# EAGLE design Tstat (EAGLE 6.5.0)
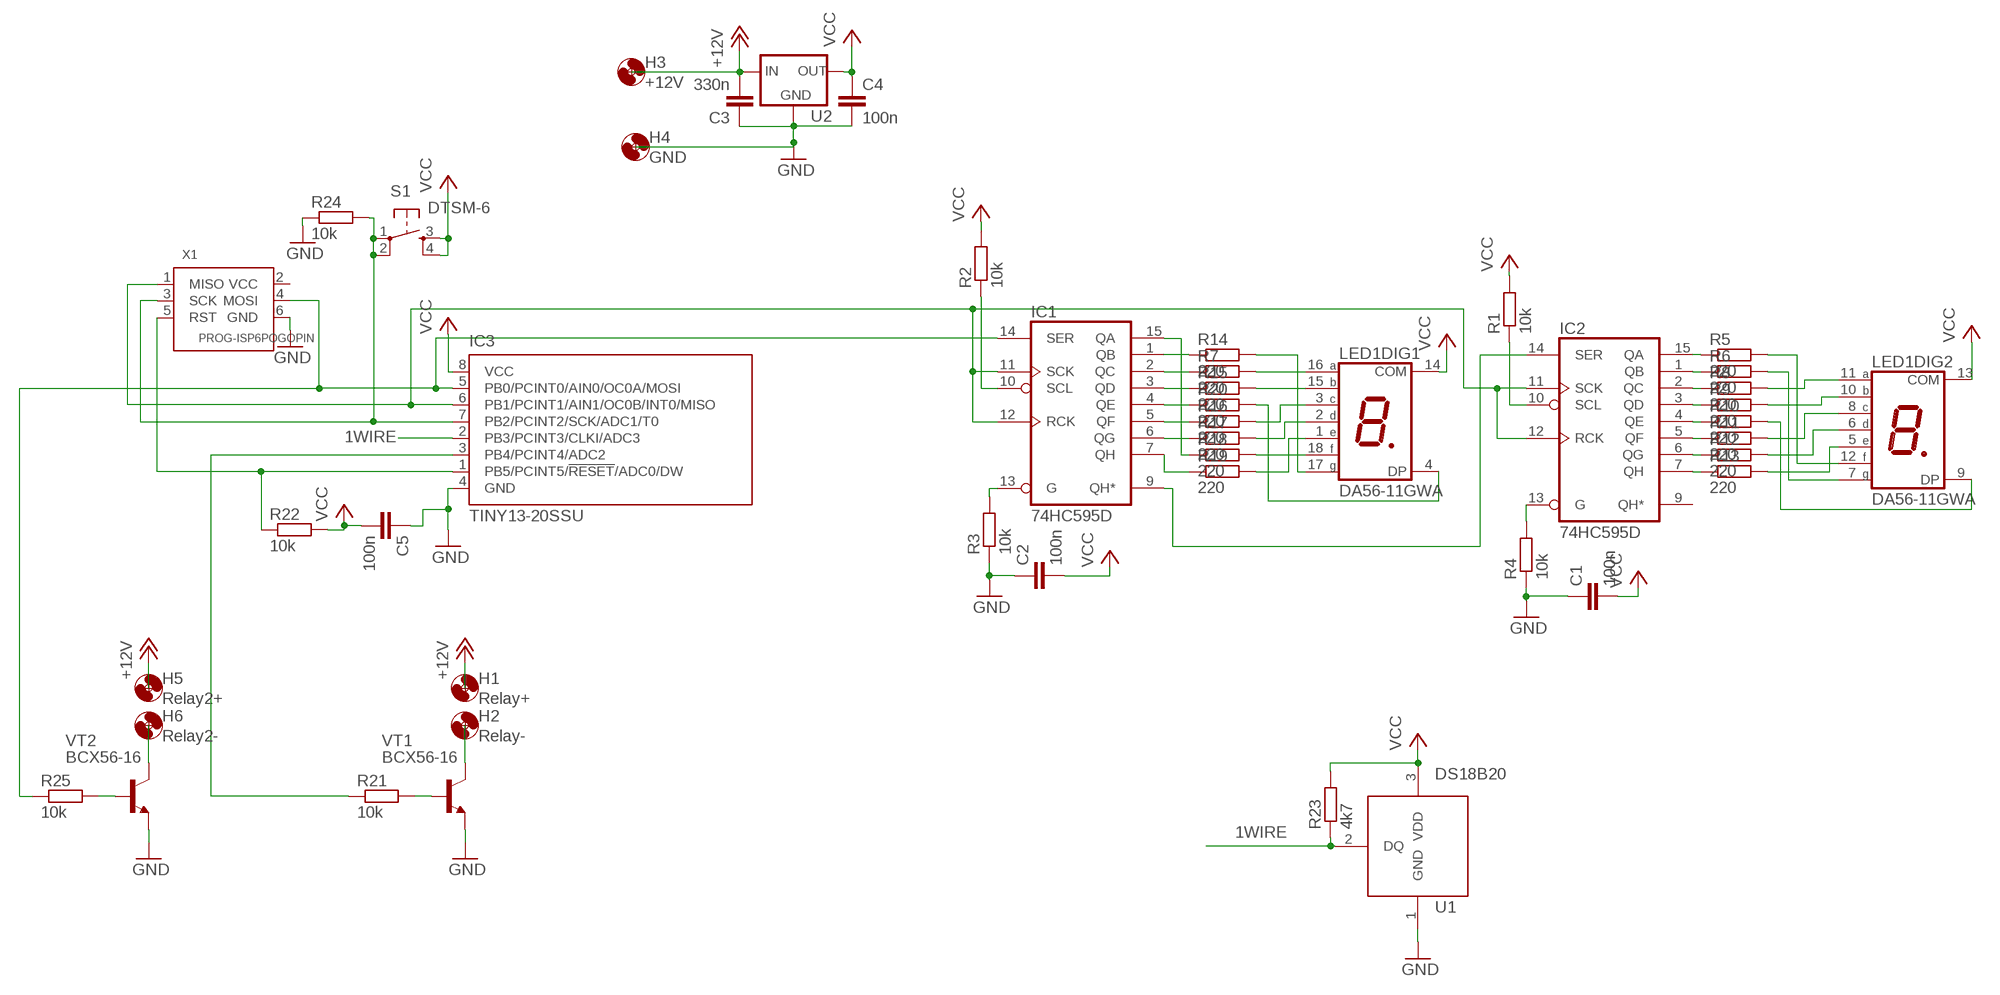
[diagram p0: schematic, sheet 1]

## Parts
C1  100n  C-EUC0805  [C0805]
C2  100n  C-EUC0805  [C0805]
C3  330n  C-EUC0805  [C0805]
C4  100n  C-EUC0805  [C0805]
C5  100n  C-EUC0805  [C0805]
H1  Relay+  MOUNT-HOLE3.0  [3,0]
H2  Relay-  MOUNT-HOLE3.0  [3,0]
H3  +12V  MOUNT-HOLE3.0  [3,0]
H4  GND  MOUNT-HOLE3.0  [3,0]
H5  Relay2+  MOUNT-HOLE3.0  [3,0]
H6  Relay2-  MOUNT-HOLE3.0  [3,0]
IC1  74HC595D  [SO16]
IC2  74HC595D  [SO16]
IC3  TINY13-20SSU  [8S1]
LED1  DA56-11GWA  [DA56]
R1  10k  R-EU_R0603  [R0603]
R2  10k  R-EU_R0603  [R0603]
R3  10k  R-EU_R0603  [R0603]
R4  10k  R-EU_R0603  [R0603]
R5  220  R-EU_R0603  [R0603]
R6  220  R-EU_R0603  [R0603]
R7  220  R-EU_R0603  [R0603]
R8  220  R-EU_R0603  [R0603]
R9  220  R-EU_R0603  [R0603]
R10  220  R-EU_R0603  [R0603]
R11  220  R-EU_R0603  [R0603]
R12  220  R-EU_R0603  [R0603]
R13  220  R-EU_R0603  [R0603]
R14  220  R-EU_R0603  [R0603]
R15  220  R-EU_R0603  [R0603]
R16  220  R-EU_R0603  [R0603]
R17  220  R-EU_R0603  [R0603]
R18  220  R-EU_R0603  [R0603]
R19  220  R-EU_R0603  [R0603]
R20  220  R-EU_R0603  [R0603]
R21  10k  R-EU_R0603  [R0603]
R22  10k  R-EU_R0603  [R0603]
R23  4k7  R-EU_R0603  [R0603]
R24  10k  R-EU_R0603  [R0603]
R25  10k  R-EU_R0603  [R0603]
S1  DTSM-6  [DTSM-6]
U1  DS18B20  [TO92]
U2  L78XX/TO263  [TO263]
VT1  BCX56-16  [SOT89-BCE]
VT2  BCX56-16  [SOT89-BCE]
X1  PROG-ISP6POGOPIN  [PROG_POGOPIN]

## Nets
1WIRE: IC3.2(PB3/PCINT3/CLKI/ADC3) R23.1 U1.2(DQ)
+12V: C3.2 H1.P$1 H3.P$1 H5.P$1 U2.1(IN)
GND: C1.1 C2.1 C3.1 C4.2 C5.1 H4.P$1 IC3.4(GND) R3.1 R4.1 R24.1 U1.1(GND) U2.3(GND) VT1.E VT2.E X1.6(GND)
N$1: IC1.15(QA) R18.1
N$2: LED1.17(DIG1:G) R14.2
N$3: LED1.16(DIG1:A) R7.2
N$4: LED1.15(DIG1:B) R15.2
N$5: LED1.4(DIG1:DP) R20.2
N$6: LED1.3(DIG1:C) R16.2
N$7: LED1.2(DIG1:D) R17.2
N$8: LED1.1(DIG1:E) R19.2
N$9: LED1.12(DIG2:F) R5.2
N$10: LED1.7(DIG2:G) R6.2
N$11: LED1.11(DIG2:A) R8.2
N$12: LED1.10(DIG2:B) R9.2
N$13: LED1.9(DIG2:DP) R10.2
N$14: LED1.8(DIG2:C) R11.2
N$15: LED1.6(DIG2:D) R12.2
N$16: LED1.5(DIG2:E) R13.2
N$17: IC1.9(QH*) IC2.14(SER)
N$18: IC2.10(SCL) R1.1
N$19: IC2.13(G) R4.2
N$20: IC1.13(G) R3.2
N$21: IC1.10(SCL) R2.1
N$22: IC2.15(QA) R5.1
N$23: IC1.11(SCK) IC1.12(RCK) IC2.11(SCK) IC2.12(RCK) IC3.6(PB1/PCINT1/AIN1/OC0B/INT0/MISO) X1.1(MISO)
N$24: IC2.1(QB) R6.1
N$25: IC2.2(QC) R8.1
N$26: IC2.3(QD) R9.1
N$27: IC2.4(QE) R10.1
N$28: IC2.5(QF) R11.1
N$29: IC2.6(QG) R12.1
N$30: IC2.7(QH) R13.1
N$31: IC1.1(QB) R14.1
N$32: IC1.2(QC) R7.1
N$33: IC1.3(QD) R15.1
N$34: IC1.5(QF) R16.1
N$35: IC1.6(QG) R17.1
N$36: LED1.18(DIG1:F) R18.2
N$37: IC1.7(QH) R19.1
N$38: IC1.4(QE) R20.1
N$39: H2.P$1 VT1.C VT1.C@1(C)
N$40: R21.2 VT1.B
N$41: IC1.14(SER) IC3.5(PB0/PCINT0/AIN0/OC0A/MOSI) R25.1 X1.4(MOSI)
N$42: H6.P$1 VT2.C VT2.C@1(C)
N$43: IC3.7(PB2/PCINT2/SCK/ADC1/T0) R24.2 S1.1 S1.2 X1.3(SCK)
N$44: IC3.1(PB5/PCINT5/!RESET!/ADC0/DW) R22.1 X1.5(RST)
N$45: R25.2 VT2.B
N$46: IC3.3(PB4/PCINT4/ADC2) R21.1
VCC: C1.2 C2.2 C4.1 C5.2 IC3.8(VCC) LED1.13(DIG2:COM) LED1.14(DIG1:COM) R1.2 R2.2 R22.2 R23.2 S1.3 S1.4 U1.3(VDD) U2.2(OUT)
Unconnected: IC2.9(QH*) X1.2(VCC)

## Power pins joined to a net without a drawn wire
GND: IC1.8(GND) IC2.8(GND)
VCC: IC1.16(VCC) IC2.16(VCC)

## Library data of the parts
C1-C5 = rcl:C-EU: CAPACITOR, European symbol
H1-H6 = holes:MOUNT-HOLE: MOUNTING HOLE with drill center marker
IC1 IC2 = 74xx-eu:74*595: 8-bit SHIFT REGISTER, output latch
IC3 = atmel:TINY13: 8-bit AVR Microcontroller with 1K Bytes In-System Programmable Flash Source: http://www.atmel.com/dyn/resources/prod_documents/2535S.pdf; MPN: ATTINY13-20SSU; OC_FARNELL: 1455133; OC_NEWARK: 58M3771
LED1 = usb:DA56-11: 14.22mm (0.56INCH) DUAL DIGIT NUMERIC DISPLAYS Source: www.kingbright.com .. DA56-11SRWA.pdf; OC_FARNELL: unknown; OC_NEWARK: unknown
R1-R25 = rcl:R-EU_: RESISTOR, European symbol
S1 = switch-tact:DTSM-6
U1 = usb:DS18B20: DS18B20
U2 = v-reg:L78XX/TO263
VT1 VT2 = usb:BCX56-16
X1 = usb:PROG-ISP

## Board
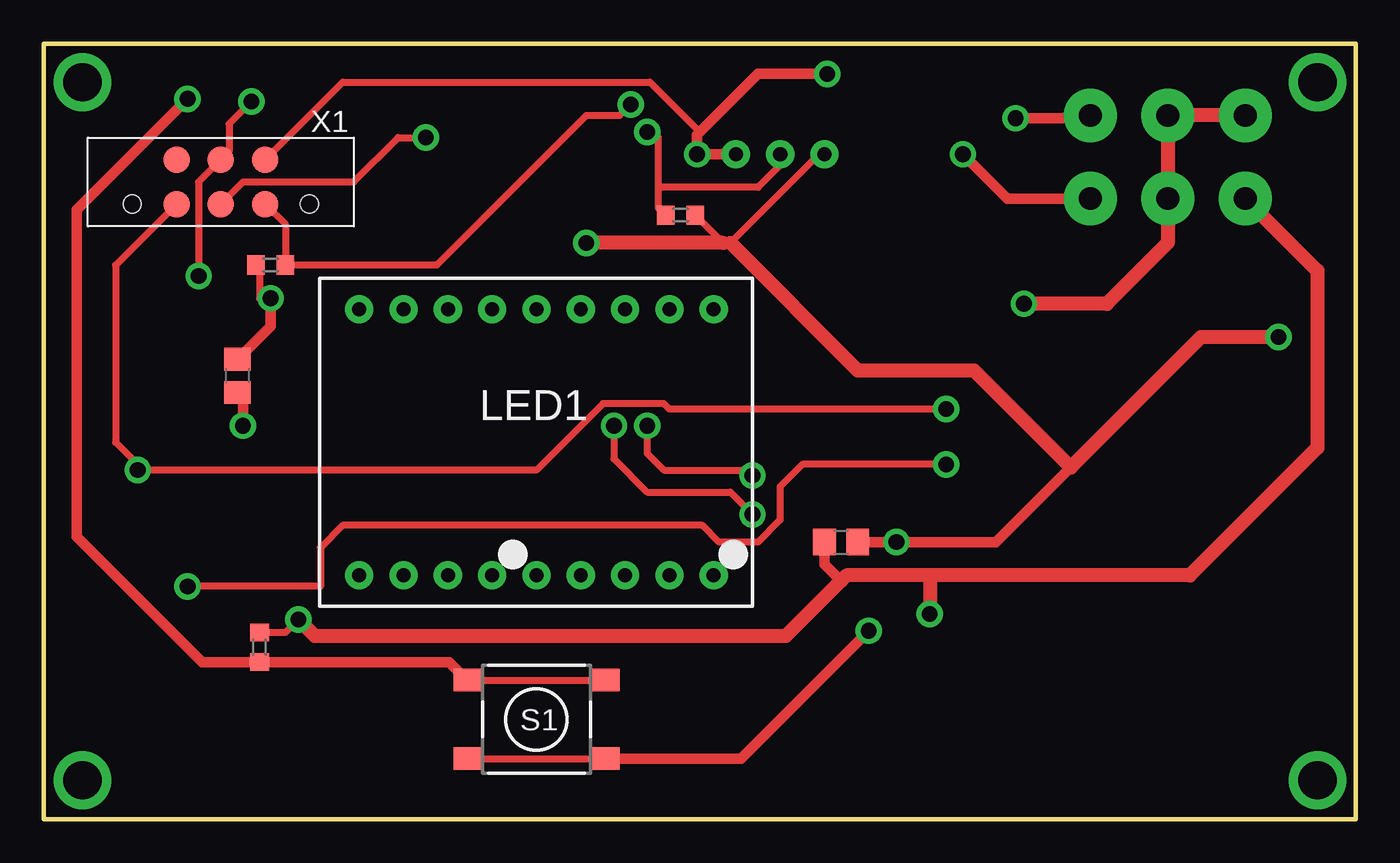
[diagram p1: board, top side]
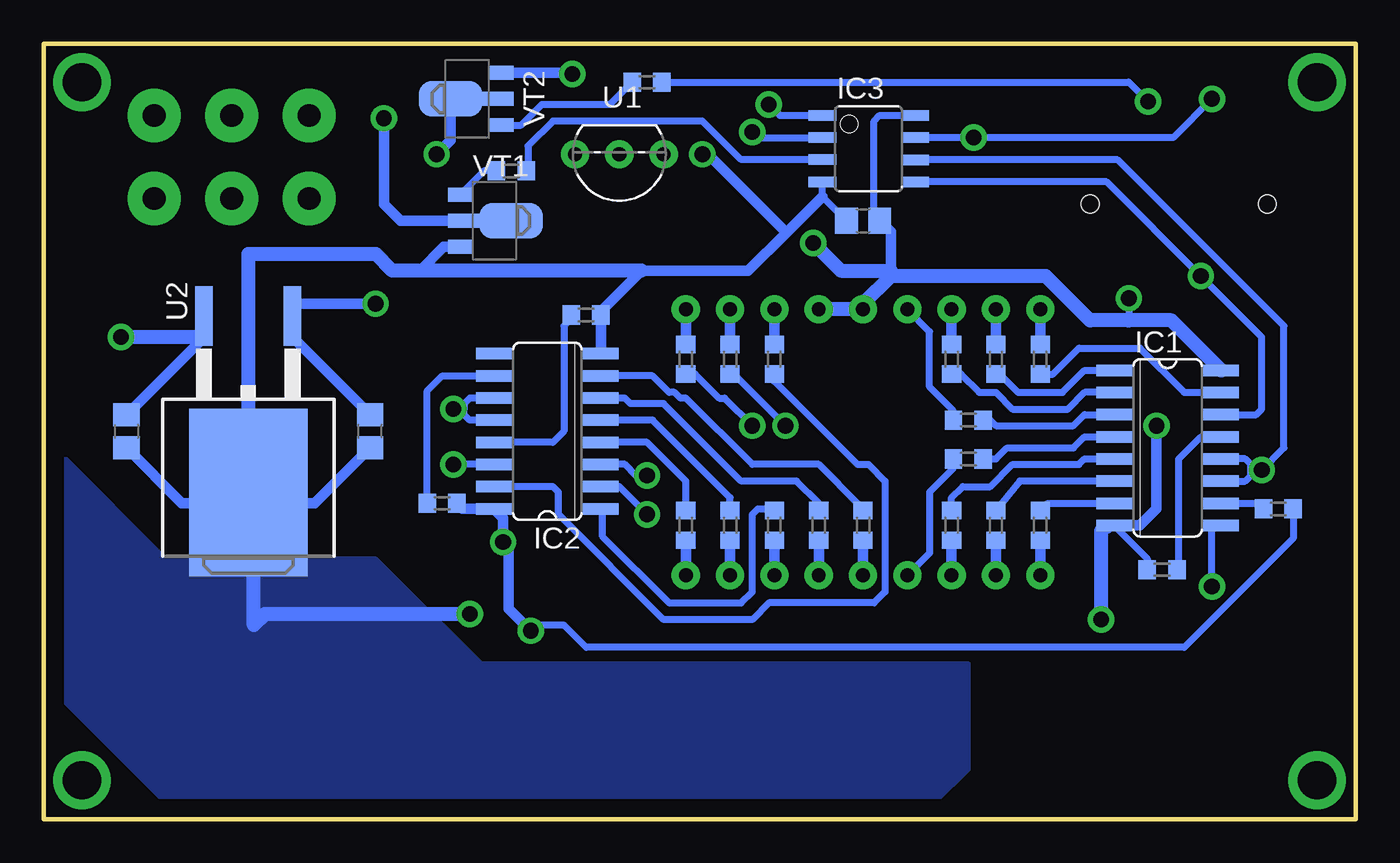
[diagram p2: board, bottom side, seen from below]

Size 75.23 x 44.44 mm. Coordinates in mm from the lower left corner, seen from the top.
Outline: 0,0 75.23,0 75.23,44.44 0,44.44 0,0
Copper layers (1*16): Top 0.035mm / dielectric 1.5mm / Bottom 0.035mm
Design rules "default": minimum track width 12mil, minimum drill 32mil, track to track 12mil, track to pad 12mil, pad to pad 12mil, via to via 12mil, smd to smd 8mil, copper to edge 40mil, drill to drill 8mil, minimum pad ring 16mil, minimum via ring 12mil, stop-mask expansion 4mil, vias tented up to drill 0mil, thermal gap 20mil

### Footprints (pad centres in the part's own frame; a part is rotated, then mirrored left to right if it is on the bottom)
C0805 = smd 1.3 x 1.5: 1 -0.95,0; 2 0.95,0
3,0 = drill 1.3 pad 3.048: P$1 0,0
SO16 = smd 0.66 x 2.032: 1 -4.445,-3.073; 2 -3.175,-3.073; 3 -1.905,-3.073; 4 -0.635,-3.073; 5 0.635,-3.073; 6 1.905,-3.073; 7 3.175,-3.073; 8 4.445,-3.073; 9 4.445,3.073; 10 3.175,3.073; 11 1.905,3.073; 12 0.635,3.073; 13 -0.635,3.073; 14 -1.905,3.073; 15 -3.175,3.073; 16 -4.445,3.073
8S1 = smd 0.6 x 1.6: 1 -1.905,-2.654; 2 -0.645,-2.654; 3 0.625,-2.654; 4 1.895,-2.654; 5 1.905,2.654; 6 0.635,2.654; 7 -0.635,2.654; 8 -1.905,2.654
DA56 = drill 0.8 pad 1.422: 1 -10.16,-7.62; 2 -7.62,-7.62; 3 -5.08,-7.62; 4 -2.54,-7.62; 5 0,-7.62; 6 2.54,-7.62; 7 5.08,-7.62; 8 7.62,-7.62; 9 10.16,-7.62; 10 10.16,7.62; 11 7.62,7.62; 12 5.08,7.62; 13 2.54,7.62; 14 0,7.62; 15 -2.54,7.62; 16 -5.08,7.62; 17 -7.62,7.62; 18 -10.16,7.62
R0603 = smd 1 x 1.1: 1 -0.85,0; 2 0.85,0
DTSM-6 = smd 1.55 x 1.3: 1 -3.975,2.25; 2 3.975,2.25; 3 -3.975,-2.25; 4 3.975,-2.25
TO92 = drill 0.813: 1 -2.54,0; 2 0,0; 3 2.54,0
TO263 = smd 1 x 3.4: 1 -2.54,-6.6; 2 2.54,-6.6 | smd 6.8 x 9.6: 3 0,3.5
SOT89-BCE = smd 0.8 x 1.4: B -1.499,-1.981; E 1.499,-1.981 | smd 0.8 x 1.9: C 0,-1.727 | smd 2.032 x 3.65: C@1 0,0.94
PROG_POGOPIN = smd 1.524 x 1.524: 1 0,7.62; 2 2.54,7.62; 3 0,5.08; 4 2.54,5.08; 5 0,2.54; 6 2.54,2.54 | hole 1.016: 0,0; 0,10.16

### Placement (x,y rotation side)
C1  45.72,15.88 0 top
C2  11.11,25.4 90 top
C3  56.52,22.23 90 bottom
C4  70.48,22.23 270 bottom
C5  28.26,34.29 0 bottom
H1  64.45,35.56 0 top
H2  60.01,40.32 0 top
H3  68.9,40.32 0 top
H4  68.9,35.56 0 top
H5  64.45,40.32 0 top
H6  60.01,35.56 0 top
IC1  10.79,21.27 270 bottom
IC2  46.35,22.23 90 bottom
IC3  27.94,38.42 270 bottom
LED1  28.26,21.59 0 top
R1  52.39,18.1 0 bottom
R2  4.45,17.78 0 bottom
R3  11.11,14.29 0 bottom
R4  44.13,28.89 180 bottom
R5  33.34,26.35 90 bottom
R6  33.34,16.83 270 bottom
R7  23.18,26.35 90 bottom
R8  35.88,26.35 90 bottom
R9  38.42,26.35 90 bottom
R10  38.42,16.83 270 bottom
R11  35.88,16.83 270 bottom
R12  30.8,16.83 270 bottom
R13  28.26,16.83 270 bottom
R14  20.64,26.35 90 bottom
R15  22.23,22.86 180 bottom
R16  23.18,16.83 270 bottom
R17  20.64,16.83 270 bottom
R18  18.1,26.35 90 bottom
R19  18.1,16.83 270 bottom
R20  22.23,20.64 180 bottom
R21  48.42,37.15 180 bottom
R22  13.02,31.75 180 top
R23  36.51,34.61 0 top
R24  12.38,9.84 270 top
R25  40.64,42.23 180 bottom
S1  28.26,5.71 0 top
U1  42.23,38.1 180 bottom
U2  63.5,22.23 180 bottom
VT1  49.37,34.29 270 bottom
VT2  50.96,41.27 90 bottom
X1  15.24,35.24 90 top

### Tracks (layer width: path | path; a pad name or v marks a point on that pad's centre or on a via)
1WIRE  (via drill 0.9)
  Top 0.406: 35.24,36.2 40.96,36.2 42.23,37.47 U1.2 | 35.24,36.2 35.24,39.05 34.92,39.37 v34.61,39.37 | R23.1 35.24,35.03 35.24,36.2
  Bottom 0.406: v34.61,39.37 34.29,39.05 30.6,39.05 IC3.2
+12V  (via drill 0.9)
  Top 0.813: H3.P$1 H5.P$1 H1.P$1 64.45,33.02 60.96,29.53 v56.2,29.53
  Bottom 0.61: C3.2 60.96,27.62 U2.1 60.96,29.53 v56.2,29.53
GND  (via drill 0.9)
  Top 0.406: X1.6 17.14,42.23 34.77,42.23 37.47,39.53 37.47,39.21 | R24.1 13.87,10.69 v14.61,11.43
  Top 0.61: C2.1 11.43,24.13 v11.43,22.54 | C1.1 44.77,14.6 45.72,13.65 | U1.1 v37.47,38.1 37.47,39.21 40.96,42.7 v44.93,42.7
  Top 0.813: H4.P$1 73.03,31.43 73.03,21.27 65.72,13.97 50.8,13.97 | 50.8,13.97 46.04,13.97 45.72,13.65 42.55,10.48 15.56,10.48 v14.61,11.43 | 50.8,13.97 v50.8,11.75
  Bottom 0.305: 14.61,16.51 14.19,16.51 IC1.8
  Bottom 0.406: IC2.8 | C5.1 30.59,35.68 IC3.4 | IC1.8 11.96,14.92 R3.1
  Bottom 0.61: IC2.8 R4.1 43.28,29.11 40.96,31.43 34.84,31.43 32.66,33.61 | 30.59,35.68 32.66,33.61 | v11.43,22.54 11.43,17.78 12.38,16.83 IC1.8 | C3.1 59.69,18.1 62.87,18.1 | 62.87,18.1 U2.3 | C4.2 67.31,18.1 63.82,18.1 62.87,18.1 | v37.47,38.1 37.15,38.1 32.66,33.61 | VT1.E 52.3,32.79 53.66,31.43 | VT2.E 45,42.77 v44.93,42.7
  Bottom 0.813: v14.61,11.43 14.61,16.51 | v50.8,11.75 62.55,11.75 63.18,11.11 63.18,17.46 63.82,18.1 | U2.3 63.5,32.38 56.2,32.38 55.24,31.43 53.66,31.43 40.96,31.43
  pour Bottom (no thermals): 68.26,14.92 56.2,14.92 50.16,8.89 22.23,8.89 22.23,2.86 24.13,0.95 68.26,0.95 74.3,6.99 74.3,20.95
N$1
  Bottom 0.406: R18.1 17.36,25.5 15.88,26.99 12.38,26.99 9.84,24.45 IC1.15
N$2
  Bottom 0.61: R14.2 LED1.17
N$3
  Bottom 0.61: R7.2 LED1.16
N$4
  Bottom 0.406: R15.2 23.07,23.39 24.45,24.77 24.45,27.94 LED1.15
N$5
  Bottom 0.406: R20.2 23.07,20.11 24.45,18.73 24.45,15.24 LED1.4
N$6
  Bottom 0.61: LED1.3 R16.2
N$7
  Bottom 0.61: LED1.2 R17.2
N$8
  Bottom 0.61: R19.2 LED1.1
N$9
  Bottom 0.61: R5.2 LED1.12
N$10
  Bottom 0.61: LED1.7 R6.2
N$11
  Bottom 0.61: R8.2 LED1.11
N$12
  Bottom 0.61: R9.2 LED1.10
N$13
  Bottom 0.61: LED1.9 R10.2
N$14
  Bottom 0.61: LED1.8 R11.2
N$15
  Bottom 0.61: LED1.6 R12.2
N$16
  Bottom 0.61: LED1.5 R13.2
N$17  (via drill 0.9)
  Top 0.406: v51.75,20.32 43.5,20.32 42.23,19.05 42.23,17.14 40.96,15.88 38.73,15.88 37.78,16.83 17.14,16.83 15.88,15.56 15.88,13.34 v8.26,13.34
  Bottom 0.406: IC2.14 v51.75,20.32 | v8.26,13.34 8.26,16.83 IC1.9
N$18
  Bottom 0.406: R1.1 53.24,24.55 52.39,25.4 IC2.10
N$19
  Bottom 0.406: R4.2 44.98,28.68 45.4,28.26 45.4,22.23 46.04,21.59 IC2.13
N$20
  Bottom 0.406: R3.2 10.16,14.39 10.16,20.64 8.89,21.91 IC1.13
N$21
  Bottom 0.406: IC1.10 5.71,18.1 5.4,17.78 R2.1
N$22
  Bottom 0.406: R5.1 33.34,25.08 28.57,20.32 27.94,20.32 26.99,19.37 26.99,13.02 27.62,12.38 33.66,12.38 34.61,11.43 39.69,11.43 45.72,17.46 45.72,18.73 46.04,19.05 IC2.15
N$23  (via drill 0.9)
  Top 0.406: v51.75,23.5 35.88,23.5 35.56,23.81 32.07,23.81 28.26,20 v5.4,20 5.4,20.32 4.13,21.59 4.13,31.75 X1.1
  Bottom 0.406: IC2.12 50.8,22.86 51.12,23.18 51.12,23.5 | IC2.11 50.8,24.13 51.12,23.81 51.12,23.5 | 51.12,23.5 v51.75,23.5 | 6.03,20 v5.4,20 4.13,21.27 4.13,28.26 13.65,37.78 IC3.6 | 6.03,20 6.03,20.32 6.35,20.64 IC1.12 | IC1.11 6.35,19.37 6.03,19.68 6.03,20
N$24
  Bottom 0.406: R6.1 33.44,17.78 34.29,17.78 34.61,17.46 34.61,13.02 35.24,12.38 39.37,12.38 43.18,16.19 43.18,17.68 IC2.1
N$25  (via drill 0.9)
  Top 0.406: v32.7,22.54 32.7,20.64 34.61,18.73 39.37,18.73 v40.64,17.46
  Bottom 0.406: R8.1 35.66,25.5 v32.7,22.54 | IC2.2 42.23,19.05 v40.64,17.46
N$26  (via drill 0.9)
  Top 0.406: v34.61,22.54 34.61,20.95 35.56,20 40.32,20 v40.64,19.68
  Bottom 0.406: R9.1 37.88,25.5 36.51,24.13 36.2,24.13 v34.61,22.54 | v40.64,19.68 41.27,19.68 41.91,20.32 IC2.3
N$27
  Bottom 0.406: R10.1 38.42,19.37 40.64,21.59 IC2.4
N$28
  Bottom 0.406: R11.1 35.88,18.41 40.32,22.86 IC2.5
N$29
  Bottom 0.406: R12.1 30.8,18.1 32.07,19.37 35.24,19.37 39.69,23.81 41.59,23.81 41.91,24.13 IC2.6
N$30
  Bottom 0.406: R13.1 28.47,18 30.8,20.32 34.61,20.32 38.42,24.13 38.73,24.13 39.05,24.45 39.37,24.45 40.32,25.4 IC2.7
N$31
  Bottom 0.406: R14.1 20.42,25.5 19.37,24.45 16.83,24.45 15.56,25.72 IC1.1
N$32
  Bottom 0.406: IC1.2 15.56,24.45 16.51,23.5 19.68,23.5 20.64,24.45 21.59,24.45 22.64,25.5 R7.1
N$33
  Bottom 0.406: R15.1 20.95,22.86 20.64,22.54 16.19,22.54 15.56,23.18 IC1.3
N$34
  Bottom 0.406: R16.1 23.18,18.41 22.54,19.05 20.95,19.05 19.68,20.32 15.88,20.32 15.56,20.64 IC1.5
N$35
  Bottom 0.406: IC1.6 19.27,19.37 R17.1
N$36
  Bottom 0.61: R18.2 LED1.18
N$37
  Bottom 0.406: 13.97,18 IC1.7 17.68,18.1 R19.1
N$38
  Bottom 0.406: R20.1 20.64,20.64 20,21.27 16.19,21.27 15.56,21.91 IC1.4
N$39  (via drill 0.9)
  Top 0.61: v55.72,40.16 59.85,40.16 H2.P$1
  Bottom 0.61: VT1.C@1 VT1.C 54.77,34.29 55.72,35.24 v55.72,40.16
N$40
  Bottom 0.406: R21.2 49.99,37.15 VT1.B
N$41  (via drill 0.9)
  Top 0.406: v8.89,31.11 8.89,36.51 X1.4 10.32,37.78 10.64,38.26 10.64,39.85 v11.91,41.12
  Bottom 0.406: IC1.14 5.71,23.18 5.4,23.5 5.4,27.62 v8.89,31.11 14.29,36.51 IC3.5 | R25.1 13.02,42.23 v11.91,41.12
N$42  (via drill 0.9)
  Top 0.61: v52.7,38.1 55.24,35.56 H6.P$1
  Bottom 0.61: VT2.C VT2.C@1 51.9,38.91 v52.7,38.1
N$43  (via drill 0.9)
  Top 0.406: X1.3 11.43,36.51 17.78,36.51 20.32,39.05 v21.91,39.05 | S1.1 S1.2
  Top 0.61: S1.1 23.25,8.99 R24.2 9.11,8.99 1.91,16.19 1.91,34.92 v8.26,41.27
  Bottom 0.406: IC3.7 v21.91,39.05 10.48,39.05 v8.26,41.27
N$44  (via drill 0.9)
  Top 0.406: v33.66,40.96 33.02,40.32 31.11,40.32 22.54,31.75 R22.1 13.87,34.08 X1.5
  Bottom 0.406: v33.66,40.96 33.02,40.32 IC3.1
N$45
  Bottom 0.406: VT2.B 47.85,39.78 46.67,40.96 42.76,40.96 R25.2
N$46
  Bottom 0.406: IC3.3 35.25,37.79 37.47,40.01 46.04,40.01 47.47,38.58 47.47,37.25 R21.1
N$48  (via drill 2.2)
  other vias: 2.22,2.22
N$49  (via drill 2.2)
  other vias: 2.22,42.23
N$50  (via drill 2.2)
  other vias: 73.03,42.23
N$51  (via drill 2.2)
  other vias: 73.03,2.22
VCC  (via drill 0.9)
  Top 0.406: v13.02,29.84 12.38,29.84 12.38,31.54 R22.2 | S1.3 S1.4 | R23.2 38.95,33.02 39.37,33.02 44.45,38.1 U1.3
  Top 0.61: C2.2 13.02,28.25 v13.02,29.84 | C1.2 v48.9,15.88 54.61,15.88 58.9,20.16 | S1.4 39.98,3.46 v47.31,10.79
  Top 0.813: 38.95,33.02 v31.11,33.02 | v70.8,27.62 66.36,27.62 58.9,20.16 53.34,25.72 46.67,25.72 39.37,33.02
  Bottom 0.406: C5.2 27.62,34.6 27.62,40.01 27.3,40.32 IC3.8 | v13.02,29.84 13.02,28.57 | R2.2 3.6,16.09 9.84,9.84 44.13,9.84 45.4,11.11 46.99,11.11 v47.31,10.79
  Bottom 0.61: C5.2 26.67,33.65 26.67,31.43 26.67,31.11 | C4.1 66.04,27.62 U2.2 | R1.2 51.22,17.78 IC2.16 48.9,17.25 v48.9,15.88 48.58,15.56 48.58,12.06 v47.31,10.79
  Bottom 0.813: IC1.16 10.58,28.57 13.02,28.57 15.24,28.57 17.78,31.11 26.67,31.11 28.26,29.53 LED1.14 LED1.13 | v31.11,33.02 29.53,31.43 26.67,31.43 | 66.04,27.62 v70.8,27.62
(copper drawn outside any net)
  shapes: Top circle x2